# EAGLE schematic rgb-segment (EAGLE 7.6.0)
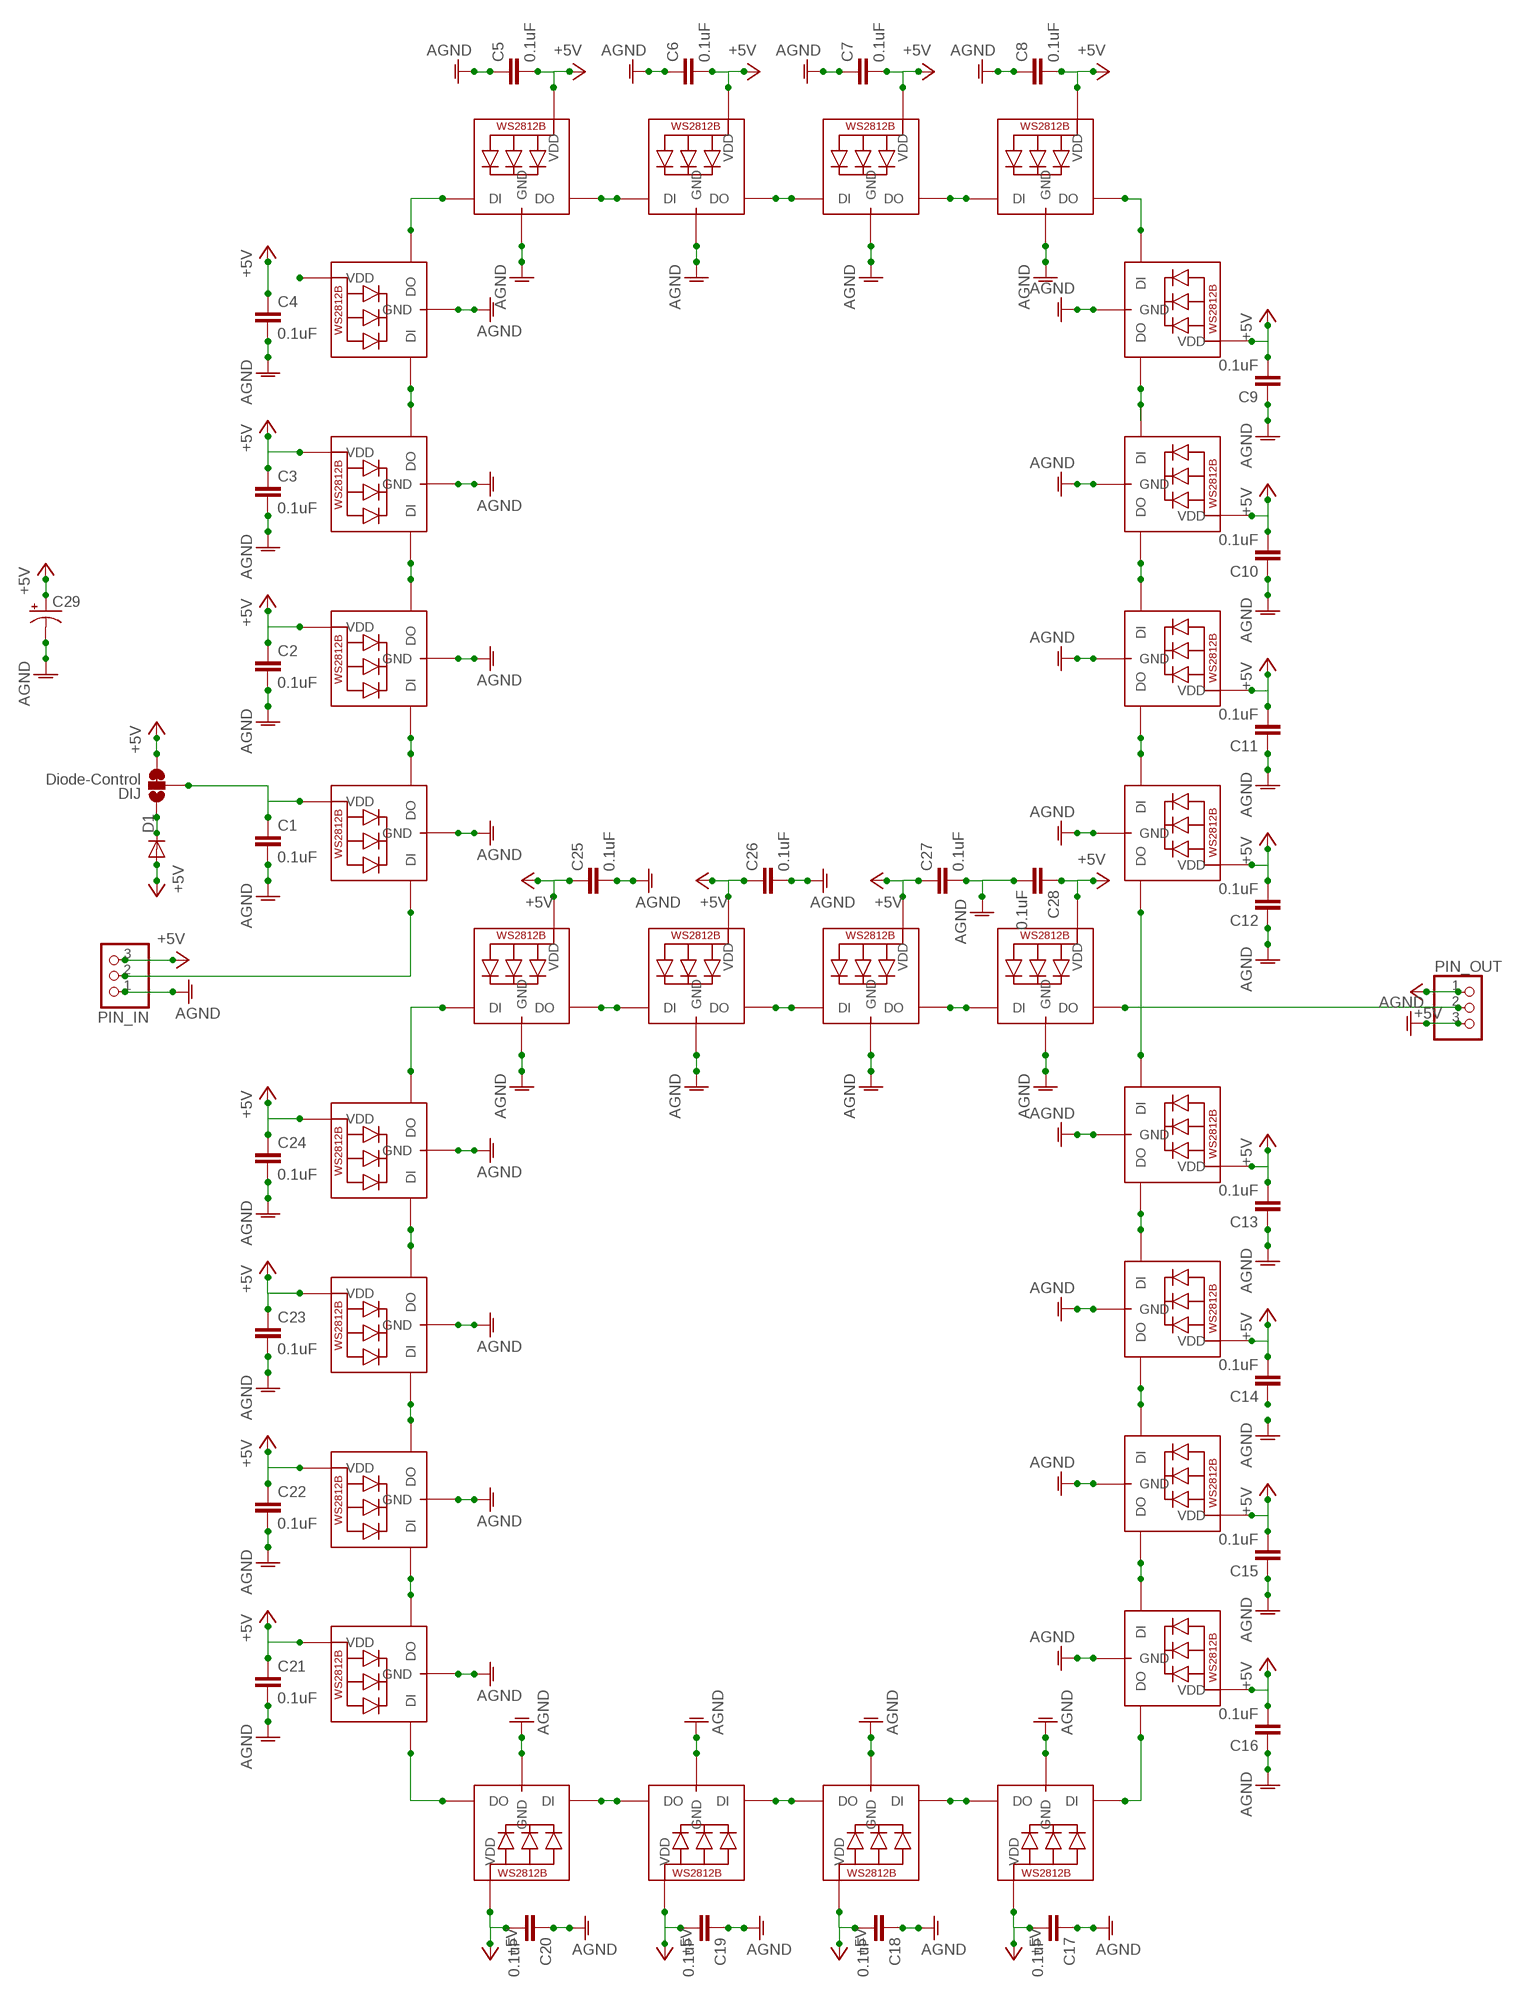
[diagram p0: schematic, sheet 1]

## Parts
C1  0.1uF  C-EUC0805  [C0805]
C2  0.1uF  C-EUC0805  [C0805]
C3  0.1uF  C-EUC0805  [C0805]
C4  0.1uF  C-EUC0805  [C0805]
C5  0.1uF  C-EUC0805  [C0805]
C6  0.1uF  C-EUC0805  [C0805]
C7  0.1uF  C-EUC0805  [C0805]
C8  0.1uF  C-EUC0805  [C0805]
C9  0.1uF  C-EUC0805  [C0805]
C10  0.1uF  C-EUC0805  [C0805]
C11  0.1uF  C-EUC0805  [C0805]
C12  0.1uF  C-EUC0805  [C0805]
C13  0.1uF  C-EUC0805  [C0805]
C14  0.1uF  C-EUC0805  [C0805]
C15  0.1uF  C-EUC0805  [C0805]
C16  0.1uF  C-EUC0805  [C0805]
C17  0.1uF  C-EUC0805  [C0805]
C18  0.1uF  C-EUC0805  [C0805]
C19  0.1uF  C-EUC0805  [C0805]
C20  0.1uF  C-EUC0805  [C0805]
C21  0.1uF  C-EUC0805  [C0805]
C22  0.1uF  C-EUC0805  [C0805]
C23  0.1uF  C-EUC0805  [C0805]
C24  0.1uF  C-EUC0805  [C0805]
C25  0.1uF  C-EUC0805  [C0805]
C26  0.1uF  C-EUC0805  [C0805]
C27  0.1uF  C-EUC0805  [C0805]
C28  0.1uF  C-EUC0805  [C0805]
C29  CAP_POLG  [PANASONIC_G]
D1  DIODE-DO214AC  [DO214AC]
DIJ  Diode-Control  JUMPER-PAD-3-2OF3_NC_BY_TRACE_SMALL  [PAD-JUMPER-3-2OF3_NC_BY_TRACE_YES_SILK_FULL_BOX]
LED1  WS2812B_5050N  [WS2812B-NARROW]
LED2  WS2812B_5050N  [WS2812B-NARROW]
LED3  WS2812B_5050N  [WS2812B-NARROW]
LED4  WS2812B_5050N  [WS2812B-NARROW]
LED5  WS2812B_5050N  [WS2812B-NARROW]
LED6  WS2812B_5050N  [WS2812B-NARROW]
LED7  WS2812B_5050N  [WS2812B-NARROW]
LED8  WS2812B_5050N  [WS2812B-NARROW]
LED9  WS2812B_5050N  [WS2812B-NARROW]
LED10  WS2812B_5050N  [WS2812B-NARROW]
LED11  WS2812B_5050N  [WS2812B-NARROW]
LED12  WS2812B_5050N  [WS2812B-NARROW]
LED13  WS2812B_5050N  [WS2812B-NARROW]
LED14  WS2812B_5050N  [WS2812B-NARROW]
LED15  WS2812B_5050N  [WS2812B-NARROW]
LED16  WS2812B_5050N  [WS2812B-NARROW]
LED17  WS2812B_5050N  [WS2812B-NARROW]
LED18  WS2812B_5050N  [WS2812B-NARROW]
LED19  WS2812B_5050N  [WS2812B-NARROW]
LED20  WS2812B_5050N  [WS2812B-NARROW]
LED21  WS2812B_5050N  [WS2812B-NARROW]
LED22  WS2812B_5050N  [WS2812B-NARROW]
LED23  WS2812B_5050N  [WS2812B-NARROW]
LED24  WS2812B_5050N  [WS2812B-NARROW]
LED25  WS2812B_5050N  [WS2812B-NARROW]
LED26  WS2812B_5050N  [WS2812B-NARROW]
LED27  WS2812B_5050N  [WS2812B-NARROW]
LED28  WS2812B_5050N  [WS2812B-NARROW]
PIN_IN  PINHD-1X3  [1X03]
PIN_OUT  PINHD-1X3  [1X03]

## Nets
+5V: C2.1 C3.1 C4.1 C5.2 C6.2 C7.2 C8.2 C9.2 C10.2 C11.2 C12.2 C13.2 C14.2 C15.2 C16.2 C17.2 C18.2 C19.2 C20.2 C21.1 C22.1 C23.1 C24.1 C25.1 C26.1 C27.1 C28.1 C29.+ D1.A DIJ.3 LED2.1-VDD(VDD) LED3.1-VDD(VDD) LED5.1-VDD(VDD) LED6.1-VDD(VDD) LED7.1-VDD(VDD) LED8.1-VDD(VDD) LED9.1-VDD(VDD) LED10.1-VDD(VDD) LED11.1-VDD(VDD) LED12.1-VDD(VDD) LED13.1-VDD(VDD) LED14.1-VDD(VDD) LED15.1-VDD(VDD) LED16.1-VDD(VDD) LED17.1-VDD(VDD) LED18.1-VDD(VDD) LED19.1-VDD(VDD) LED20.1-VDD(VDD) LED21.1-VDD(VDD) LED22.1-VDD(VDD) LED23.1-VDD(VDD) LED24.1-VDD(VDD) LED25.1-VDD(VDD) LED26.1-VDD(VDD) LED27.1-VDD(VDD) LED28.1-VDD(VDD) PIN_IN.3 PIN_OUT.1
AGND: C1.2 C2.2 C3.2 C4.2 C5.1 C6.1 C7.1 C8.1 C9.1 C10.1 C11.1 C12.1 C13.1 C15.1 C16.1 C17.1 C18.1 C19.1 C20.1 C21.2 C22.2 C23.2 C24.2 C25.2 C26.2 C27.2 C28.2 C29.- LED1.3-GND(GND) LED2.3-GND(GND) LED3.3-GND(GND) LED4.3-GND(GND) LED5.3-GND(GND) LED6.3-GND(GND) LED7.3-GND(GND) LED8.3-GND(GND) LED9.3-GND(GND) LED10.3-GND(GND) LED11.3-GND(GND) LED12.3-GND(GND) LED13.3-GND(GND) LED14.3-GND(GND) LED15.3-GND(GND) LED16.3-GND(GND) LED17.3-GND(GND) LED18.3-GND(GND) LED19.3-GND(GND) LED20.3-GND(GND) LED21.3-GND(GND) LED22.3-GND(GND) LED23.3-GND(GND) LED24.3-GND(GND) LED25.3-GND(GND) LED26.3-GND(GND) LED27.3-GND(GND) LED28.3-GND(GND) PIN_IN.1 PIN_OUT.3
N$1: LED17.2-DOUT(DO) LED18.4-DIN(DI)
N$2: LED4.1-VDD(VDD)
N$3: LED18.2-DOUT(DO) LED19.4-DIN(DI)
N$4: LED1.4-DIN(DI) PIN_IN.2
N$5: LED19.2-DOUT(DO) LED20.4-DIN(DI)
N$9: C1.1 DIJ.2 LED1.1-VDD(VDD)
N$10: D1.C DIJ.1
N$12: LED5.2-DOUT(DO) LED6.4-DIN(DI)
N$14: LED6.2-DOUT(DO) LED7.4-DIN(DI)
N$16: LED7.2-DOUT(DO) LED8.4-DIN(DI)
N$17: LED8.2-DOUT(DO) LED9.4-DIN(DI)
N$18: LED28.2-DOUT(DO) PIN_OUT.2
N$19: LED4.2-DOUT(DO) LED5.4-DIN(DI)
N$21: LED3.2-DOUT(DO) LED4.4-DIN(DI)
N$23: LED9.2-DOUT(DO) LED10.4-DIN(DI)
N$24: LED10.2-DOUT(DO) LED11.4-DIN(DI)
N$26: LED2.2-DOUT(DO) LED3.4-DIN(DI)
N$28: LED1.2-DOUT(DO) LED2.4-DIN(DI)
N$30: LED11.2-DOUT(DO) LED12.4-DIN(DI)
N$33: LED12.2-DOUT(DO) LED13.4-DIN(DI)
N$41: LED24.2-DOUT(DO) LED25.4-DIN(DI)
N$42: LED13.2-DOUT(DO) LED14.4-DIN(DI)
N$44: LED14.2-DOUT(DO) LED15.4-DIN(DI)
N$46: LED15.2-DOUT(DO) LED16.4-DIN(DI)
N$48: LED16.2-DOUT(DO) LED17.4-DIN(DI)
N$55: LED20.2-DOUT(DO) LED21.4-DIN(DI)
N$59: LED21.2-DOUT(DO) LED22.4-DIN(DI)
N$61: C14.1
N$62: LED22.2-DOUT(DO) LED23.4-DIN(DI)
N$65: LED23.2-DOUT(DO) LED24.4-DIN(DI)
N$70: LED25.2-DOUT(DO) LED26.4-DIN(DI)
N$72: LED26.2-DOUT(DO) LED27.4-DIN(DI)
N$74: LED27.2-DOUT(DO) LED28.4-DIN(DI)

## Library data of the parts
C1-C28 = rcl:C-EU: CAPACITOR, European symbol
C29 = SparkFun-Passives:CAP_POL: Capacitor Polarized These are standard SMD and PTH capacitors. Normally 10uF, 47uF, and 100uF in electrolytic and tantalum varieties. Always verify the external diameter of the through hole cap, it varies with capacity, voltage, and manufacturer. The EIA devices should be standard.
D1 = diode:DIODE-: DIODE
DIJ = SparkFun-Passives:JUMPER-PAD-3-2OF3_NC_BY_TRACE
LED1-LED28 = adafruit:WS2812B
PIN_IN PIN_OUT = pinhead:PINHD-1X3: PIN HEADER